# EAGLE design atmega8 (EAGLE 7.4.0)
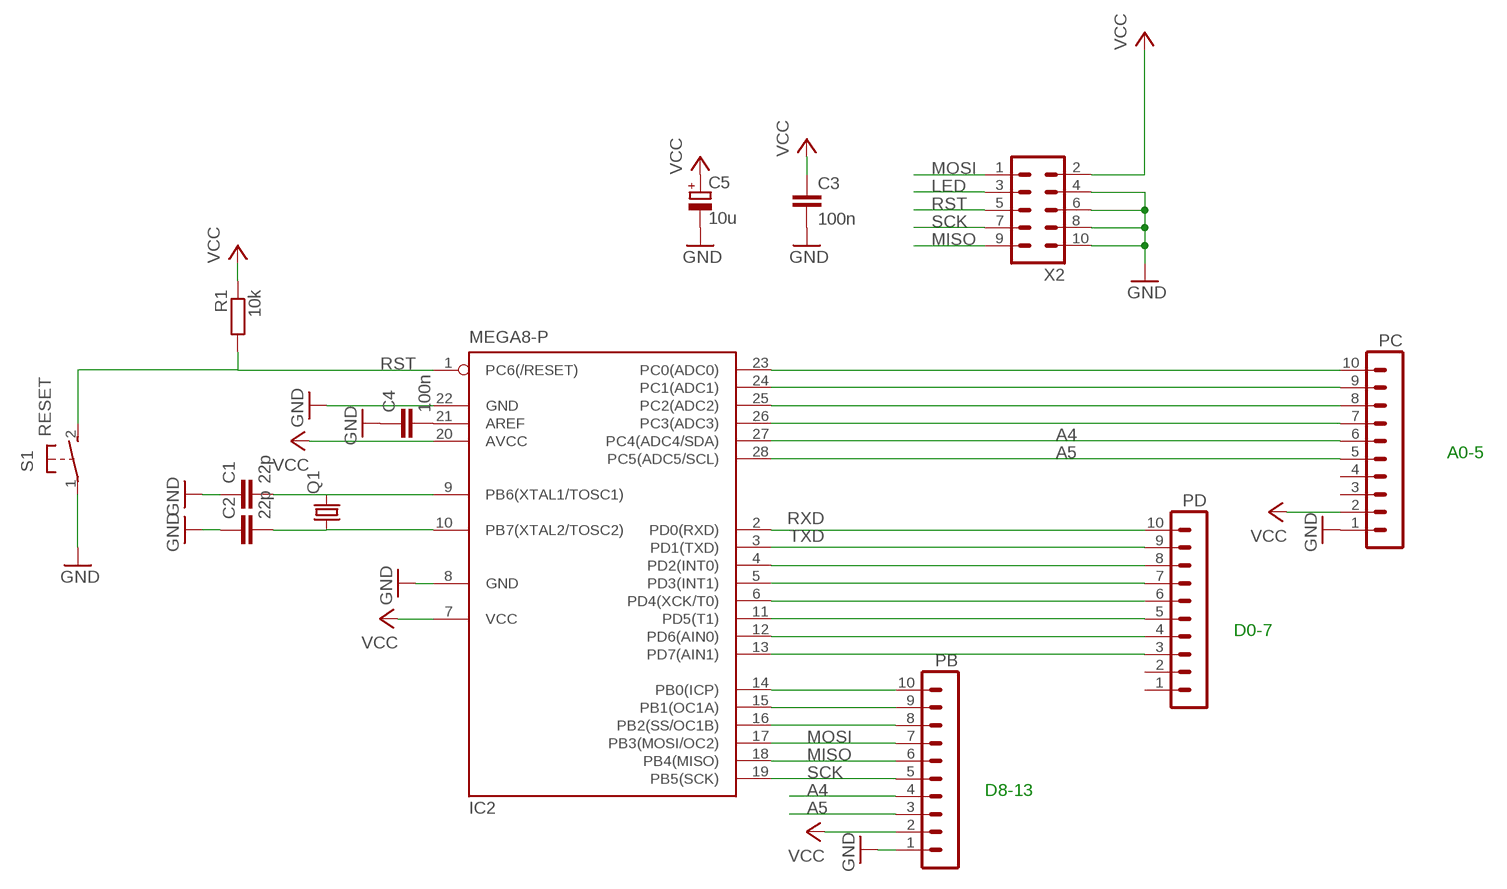
[diagram p0: schematic, sheet 1]

## Parts
C1  22p  C-EU025-024X044  [C025-024X044]
C2  22p  C-EU050-025X075  [C050-025X075]
C3  100n  C-EU025-024X044  [C025-024X044]
C4  100n  C-EU025-024X044  [C025-024X044]
C5  10u  CPOL-EUE2,5-6E  [E2,5-6E]
IC2  MEGA8-P  [DIL28-3]
PB  MA10-1W  [MA10-1W]
PC  MA10-1W  [MA10-1W]
PD  MA10-1W  [MA10-1W]
Q1  CRYSTALTC26V  [TC26V]
R1  10k  R-EU_0204/7  [0204/7]
S1  RESET  31-XX  [B3F-31XX]
X2  ML10L  [ML10L]

## Nets
A4: IC2.27(PC4(ADC4/SDA)) PB.4 PC.6
A5: IC2.28(PC5(ADC5/SCL)) PB.3 PC.5
GND: C1.1 C2.1 C3.2 C4.1 C5.- IC2.8(GND) IC2.22(GND) PB.1 PC.1 S1.1(P) X2.4 X2.6 X2.8 X2.10
LED: X2.3
MISO: IC2.18(PB4(MISO)) PB.6 X2.9
MOSI: IC2.17(PB3(MOSI/OC2)) PB.7 X2.1
N$1: IC2.11(PD5(T1)) PD.5
N$2: IC2.23(PC0(ADC0)) PC.10
N$3: IC2.13(PD7(AIN1)) PD.3
N$4: IC2.24(PC1(ADC1)) PC.9
N$5: IC2.25(PC2(ADC2)) PC.8
N$6: IC2.26(PC3(ADC3)) PC.7
N$11: IC2.4(PD2(INT0)) PD.8
N$12: IC2.5(PD3(INT1)) PD.7
N$14: IC2.6(PD4(XCK/T0)) PD.6
N$15: C4.2 IC2.21(AREF)
N$16: IC2.12(PD6(AIN0)) PD.4
N$17: IC2.1(PC6(/RESET)) R1.2 S1.2(S)
N$18: IC2.15(PB1(OC1A)) PB.9
N$19: C1.2 IC2.9(PB6(XTAL1/TOSC1)) Q1.2
N$22: C2.2 IC2.10(PB7(XTAL2/TOSC2)) Q1.1
N$26: IC2.14(PB0(ICP)) PB.10
N$27: IC2.16(PB2(SS/OC1B)) PB.8
RST: X2.5
RXD: IC2.2(PD0(RXD)) PD.10
SCK: IC2.19(PB5(SCK)) PB.5 X2.7
TXD: IC2.3(PD1(TXD)) PD.9
VCC: C3.1 C5.+ IC2.7(VCC) IC2.20(AVCC) PB.2 PC.2 R1.1 X2.2
Unconnected: PC.3 PC.4 PD.1 PD.2

## Notes on the sheet
- A0-5
- D0-7
- D8-13

## Library data of the parts
C1-C4 = rcl:C-EU: CAPACITOR, European symbol
C5 = rcl:CPOL-EU: POLARIZED CAPACITOR, European symbol
IC2 = atmel:MEGA8-P: MICROCONTROLLER 8 Kbytes FLASH, 1 kbytes SRAM, 512 bytes EEPROM, USART, 4-channel 10 bit ADC, 2-channel 8 bit ADC Pin compatible with Atmega48, ATMega88, ATMega168 Source: avr.lbr
PB PC PD = con-lstb:MA10-1W: PIN HEADER
Q1 = crystal:CRYSTAL: CRYSTAL
R1 = rcl:R-EU_: RESISTOR, European symbol
S1 = switch-omron:31-XX: OMRON SWITCH
X2 = con-harting-ml:ML10: HARTING

## Board
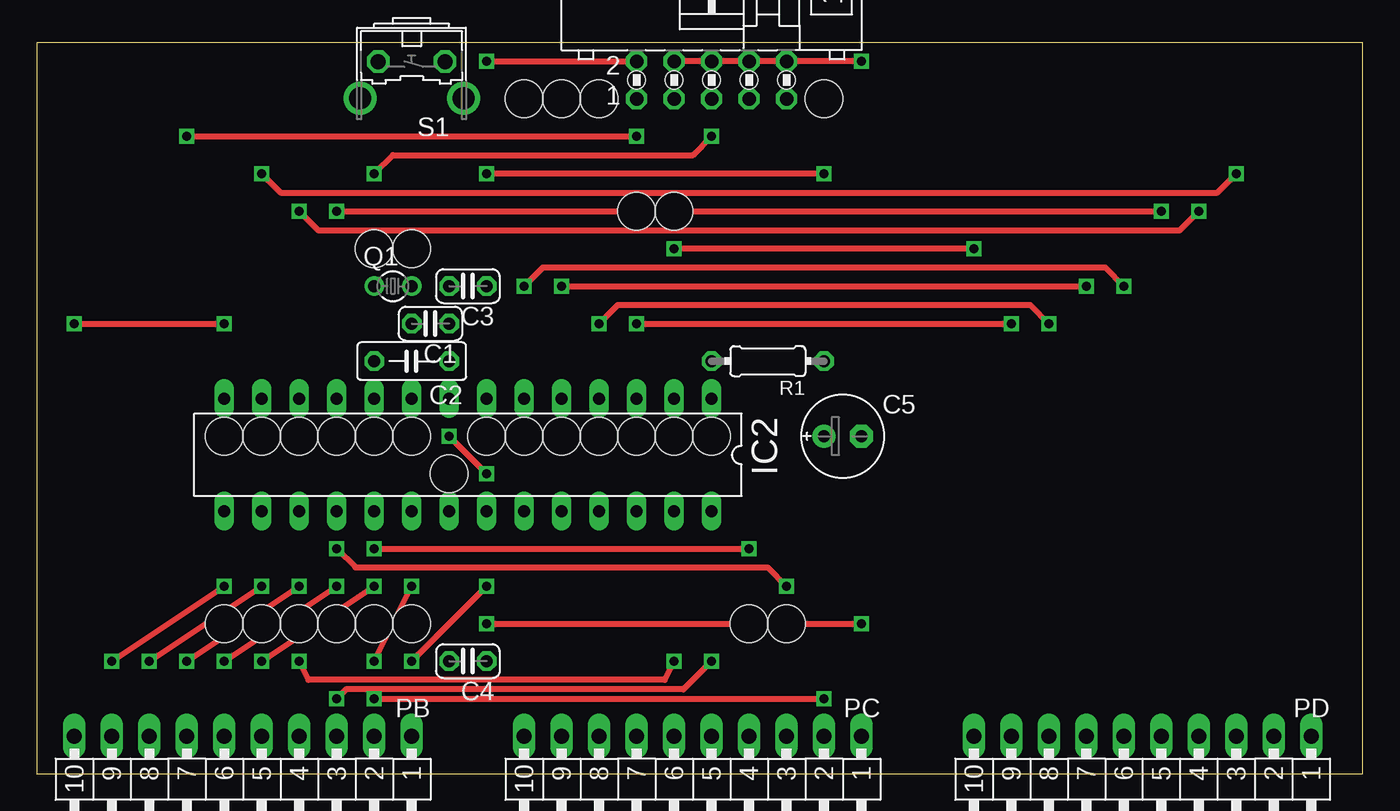
[diagram p1: board, top side]
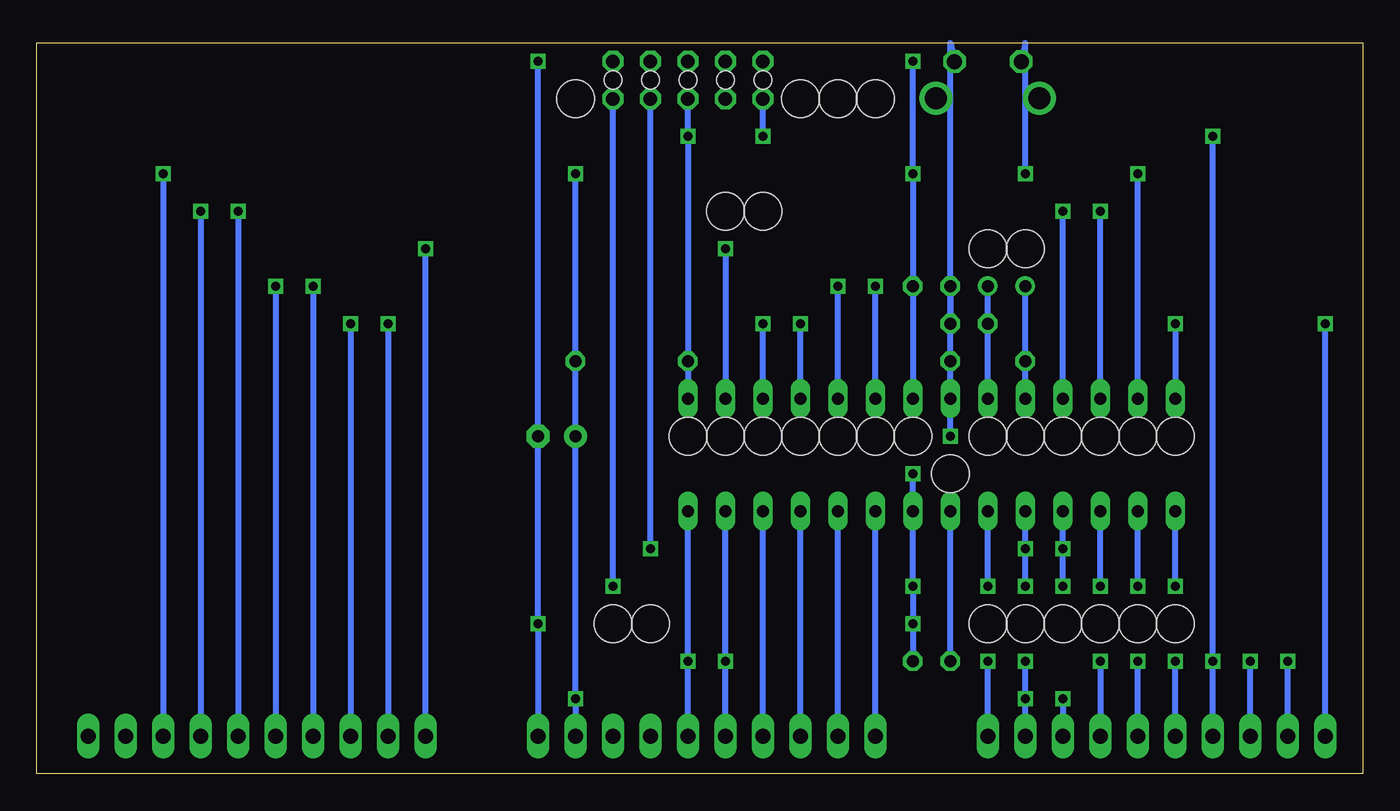
[diagram p2: board, bottom side, seen from below]

Size 89.84 x 49.52 mm. Coordinates in mm from the lower left corner, seen from the top.
Outline: 0,0 89.84,0 89.84,49.52 0,49.52 0,0
Copper layers (1*16): Top 0.035mm / dielectric 1.5mm / Bottom 0.035mm
Design rules "default": minimum track width 10mil, minimum drill 24mil, track to track 8mil, track to pad 8mil, pad to pad 8mil, via to via 8mil, smd to smd 8mil, copper to edge 40mil, drill to drill 8mil, minimum pad ring 10mil, minimum via ring 8mil, stop-mask expansion 4mil, vias tented up to drill 0mil, thermal gap 10mil
Holes 2.54 mm at 12.7,10.16 15.24,10.16 17.78,10.16 20.32,10.16 22.86,10.16 25.4,10.16 50.8,10.16 12.7,22.86 15.24,22.86 17.78,22.86 20.32,22.86 22.86,22.86 25.4,22.86 33.02,22.86 35.56,22.86 27.94,20.32 38.1,22.86 43.18,22.86 40.64,22.86 45.72,22.86 40.64,38.1 48.26,10.16 43.18,38.1 53.34,45.72 38.1,45.72 35.56,45.72 33.02,45.72 30.48,22.86 22.86,35.56 25.4,35.56
Holes 1.2 mm at 50.8,46.99 48.26,46.99 45.72,46.99 43.18,46.99 40.64,46.99

### Footprints (pad centres in the part's own frame; a part is rotated, then mirrored left to right if it is on the bottom)
C025-024X044 = drill 0.813 octagon: 1 -1.27,0; 2 1.27,0
C050-025X075 = drill 0.813 octagon: 1 -2.54,0; 2 2.54,0
E2,5-6E = drill 0.813 pad 1.575: + -1.27,0 | drill 0.813 pad 1.575 octagon: - 1.27,0
DIL28-3 = drill 0.813 long: 1 -16.51,-3.81; 2 -13.97,-3.81; 3 -11.43,-3.81; 4 -8.89,-3.81; 5 -6.35,-3.81; 6 -3.81,-3.81; 7 -1.27,-3.81; 8 1.27,-3.81; 9 3.81,-3.81; 10 6.35,-3.81; 11 8.89,-3.81; 12 11.43,-3.81; 13 13.97,-3.81; 14 16.51,-3.81; 15 16.51,3.81; 16 13.97,3.81; 17 11.43,3.81; 18 8.89,3.81; 19 6.35,3.81; 20 3.81,3.81; 21 1.27,3.81; 22 -1.27,3.81; 23 -3.81,3.81; 24 -6.35,3.81; 25 -8.89,3.81; 26 -11.43,3.81; 27 -13.97,3.81; 28 -16.51,3.81
MA10-1W = drill 1.016 long: 1 -11.43,0; 2 -8.89,0; 3 -6.35,0; 4 -3.81,0; 5 -1.27,0; 6 1.27,0; 7 3.81,0; 8 6.35,0; 9 8.89,0; 10 11.43,0
TC26V = drill 0.813: 1 -1.27,0; 2 1.27,0
0204/7 = drill 0.813 octagon: 1 -3.81,0; 2 3.81,0
B3F-31XX = drill 1.016 octagon: 1 -2.261,-1.245; 2 2.261,-1.245 | drill 1.499 pad 2.159: 3 -3.505,1.245; 4 3.505,1.245
ML10L = drill 0.914 octagon: 1 -5.08,-1.27; 2 -5.08,1.27; 3 -2.54,-1.27; 4 -2.54,1.27; 5 0,-1.27; 6 0,1.27; 7 2.54,-1.27; 8 2.54,1.27; 9 5.08,-1.27; 10 5.08,1.27

### Placement (x,y rotation side)
C1  26.67,30.48 180 top
C2  25.4,27.94 180 top
C3  29.21,33.02 180 top
C4  29.21,7.62 180 top
C5  54.61,22.86 0 top
IC2  29.21,21.59 180 top
PB  13.97,2.54 180 top
PC  44.45,2.54 180 top
PD  74.93,2.54 180 top
Q1  24.13,33.02 0 top
R1  49.53,27.94 180 top
S1  25.4,46.99 180 top
X2  45.72,46.99 0 top

### Tracks (layer width: path | path; a pad name or v marks a point on that pad's centre or on a via)
A4  (via drill 0.6)
  Top 0.406: v43.18,7.62 42.55,6.35 18.41,6.35 v17.78,7.62
  Bottom 0.406: IC2.27 v43.18,7.62 PC.6 | v17.78,7.62 PB.4
A5  (via drill 0.6)
  Top 0.406: v45.72,7.62 43.81,5.71 20.95,5.71 v20.32,5.08
  Bottom 0.406: IC2.28 v45.72,7.62 PC.5 | v20.32,5.08 PB.3
GND  (via drill 0.6)
  Top 0.406: v30.48,20.32 v27.94,22.86 | X2.4 X2.6 X2.8 X2.10 v55.88,48.26 | v25.4,7.62 v30.48,12.7 | v30.48,10.16 v55.88,10.16
  Bottom 0.406: v27.94,22.86 IC2.8 C3.2 C1.1 27.94,49.51 S1.1 | v30.48,20.32 IC2.22 v30.48,12.7 v30.48,10.16 C4.1 | PB.1 v25.4,7.62 | PC.1 v55.88,10.16 C5.- v55.88,48.26
MISO  (via drill 0.6)
  Top 0.406: v12.7,7.62 v20.32,12.7 | v20.32,15.24 21.59,13.97 49.53,13.97 v50.8,12.7
  Bottom 0.406: v20.32,12.7 v20.32,15.24 IC2.18 | PB.6 v12.7,7.62 | v50.8,12.7 X2.9
MOSI  (via drill 0.6)
  Top 0.406: v10.16,7.62 v17.78,12.7 | v10.16,43.18 v40.64,43.18
  Bottom 0.406: v17.78,12.7 IC2.17 | PB.7 v10.16,7.62 v10.16,43.18 | v40.64,43.18 X2.1
N$1  (via drill 0.6)
  Top 0.406: v20.32,38.1 v76.2,38.1
  Bottom 0.406: v76.2,38.1 PD.5 | IC2.11 v20.32,38.1
N$2
  Bottom 0.406: PC.10 IC2.23
N$3  (via drill 0.6)
  Top 0.406: v15.24,40.64 16.51,39.37 80.01,39.37 v81.28,40.64
  Bottom 0.406: v81.28,40.64 PD.3 | IC2.13 v15.24,40.64
N$4
  Bottom 0.406: PC.9 IC2.24
N$5
  Bottom 0.406: PC.8 IC2.25
N$6
  Bottom 0.406: PC.7 IC2.26
N$9  (via drill 0.6)
  other vias: 53.34,40.64
N$11  (via drill 0.6)
  Top 0.406: v38.1,30.48 39.37,31.75 67.31,31.75 v68.58,30.48
  Bottom 0.406: v68.58,30.48 PD.8 | IC2.4 v38.1,30.48
N$12  (via drill 0.6)
  Top 0.406: v35.56,33.02 v71.12,33.02
  Bottom 0.406: IC2.5 v35.56,33.02 | v71.12,33.02 PD.7
N$14  (via drill 0.6)
  Top 0.406: v33.02,33.02 34.29,34.29 72.39,34.29 v73.66,33.02
  Bottom 0.406: IC2.6 v33.02,33.02 | v73.66,33.02 PD.6
N$15
  Bottom 0.406: C4.2 IC2.21
N$16  (via drill 0.6)
  Top 0.406: v78.74,38.1 77.47,36.83 19.05,36.83 v17.78,38.1
  Bottom 0.406: v78.74,38.1 PD.4 | IC2.12 v17.78,38.1
N$17  (via drill 0.6)
  Top 0.406: v22.86,40.64 24.13,41.91 44.45,41.91 v45.72,43.18
  Bottom 0.406: 45.72,45.72 v45.72,43.18 R1.2 IC2.1 | S1.2 22.86,49.51 v22.86,40.64
N$18  (via drill 0.6)
  Top 0.406: v5.08,7.62 v12.7,12.7
  Bottom 0.406: v12.7,12.7 IC2.15 | PB.9 v5.08,7.62
N$19
  Bottom 0.406: IC2.9 C1.2 Q1.2
N$22
  Bottom 0.406: IC2.10 C2.2 Q1.1
N$26  (via drill 0.6)
  Top 0.406: v2.54,30.48 v12.7,30.48
  Bottom 0.406: PB.10 v2.54,30.48 | v12.7,30.48 IC2.14
N$27  (via drill 0.6)
  Top 0.406: v7.62,7.62 v15.24,12.7
  Bottom 0.406: v15.24,12.7 IC2.16 | PB.8 v7.62,7.62
RXD  (via drill 0.6)
  Top 0.406: v63.5,35.56 v43.18,35.56
  Bottom 0.406: PD.10 v63.5,35.56 | v43.18,35.56 IC2.2
SCK  (via drill 0.6)
  Top 0.406: v15.24,7.62 v22.86,12.7 | v22.86,15.24 v48.26,15.24
  Bottom 0.406: PB.5 v15.24,7.62 | v22.86,12.7 v22.86,15.24 IC2.19 | v48.26,15.24 X2.7
TXD  (via drill 0.6)
  Top 0.406: v40.64,30.48 v66.04,30.48
  Bottom 0.406: v66.04,30.48 PD.9 | IC2.3 v40.64,30.48
VCC  (via drill 0.6)
  Top 0.406: v22.86,7.62 v25.4,12.7 | v30.48,48.26 X2.2 | v53.34,40.64 v30.48,40.64 | v22.86,5.08 v53.34,5.08
  Bottom 0.406: IC2.7 C3.1 v30.48,40.64 v30.48,48.26 | PB.2 v22.86,5.08 v22.86,7.62 | v25.4,12.7 IC2.20 | PC.2 v53.34,5.08 C5.+ R1.1 v53.34,40.64

### Text on the board
Top: D8-13 | A0-A5 | D0-7